# Altium schematic sheet 电源.SchDoc
size A4
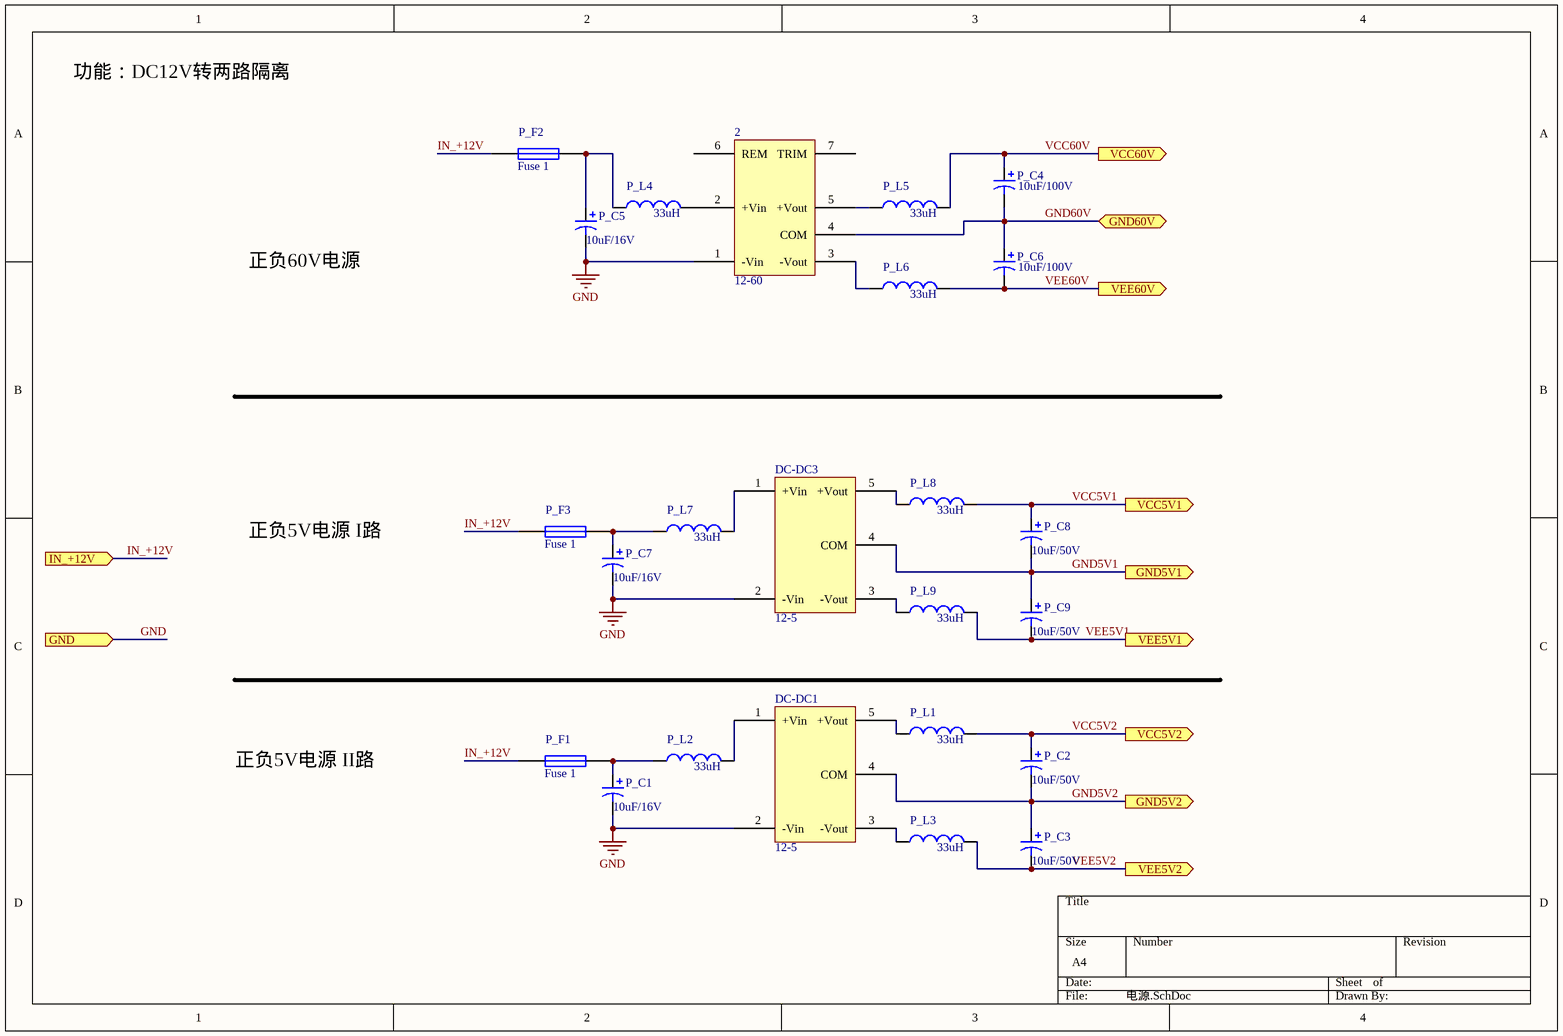
[diagram p0: 电源.SchDoc]

## Parts
2  12-60  [12-60]
DC-DC1  12-5  [12-5]
DC-DC3  12-5  [12-5]
P_C1  value 10uF/16V  [cap_2.54]  (hidden comment: Cap Pol3)
P_C2  value 10uF/50V  [cap_2.54]  (hidden comment: Cap Pol3)
P_C3  value 10uF/50V  [cap_2.54]  (hidden comment: Cap Pol3)
P_C4  10uF/100V  [cap_2.54]
P_C5  value 10uF/16V  [cap_2.54]  (hidden comment: Cap Pol3)
P_C6  10uF/100V  [cap_2.54]
P_C7  value 10uF/16V  [cap_2.54]  (hidden comment: Cap Pol3)
P_C8  value 10uF/50V  [cap_2.54]  (hidden comment: Cap Pol3)
P_C9  value 10uF/50V  [cap_2.54]  (hidden comment: Cap Pol3)
P_F1  Fuse 1  [HDR1X2]
P_F2  Fuse 1  [HDR1X2]
P_F3  Fuse 1  [HDR1X2]
P_L1  value 33uH  [AXIAL-0.4]  (hidden comment: Inductor)
P_L2  value 33uH  [AXIAL-0.4]  (hidden comment: Inductor)
P_L3  value 33uH  [AXIAL-0.4]  (hidden comment: Inductor)
P_L4  value 33uH  [AXIAL-0.4]  (hidden comment: Inductor)
P_L5  value 33uH  [AXIAL-0.4]  (hidden comment: Inductor)
P_L6  value 33uH  [AXIAL-0.4]  (hidden comment: Inductor)
P_L7  value 33uH  [AXIAL-0.4]  (hidden comment: Inductor)
P_L8  value 33uH  [AXIAL-0.4]  (hidden comment: Inductor)
P_L9  value 33uH  [AXIAL-0.4]  (hidden comment: Inductor)

## Ports
GND5V1 (out), GND5V2 (out), GND60V, GND (in), IN_+12V (in), VCC5V1 (out), VCC5V2 (out), VCC60V, VEE5V1 (out), VEE5V2 (out), VEE60V

## Nets
GND: 2.1(-Vin) DC-DC1.2(-Vin) DC-DC3.2(-Vin) P_C1.2 P_C5.2 P_C7.2 ; port GND
GND5V1: DC-DC3.4(COM) P_C8.2 P_C9.1 ; port GND5V1
GND5V2: DC-DC1.4(COM) P_C2.2 P_C3.1 ; port GND5V2
GND60V: 2.4(COM) P_C4.2 P_C6.1 ; port GND60V
IN_+12V: P_F1.1 P_F2.1 P_F3.1 ; port IN_+12V
VCC5V1: P_C8.1 P_L8.2 ; port VCC5V1
VCC5V2: P_C2.1 P_L1.2 ; port VCC5V2
VCC60V: P_C4.1 P_L5.2 ; port VCC60V
VEE5V1: P_C9.2 P_L9.2 ; port VEE5V1
VEE5V2: P_C3.2 P_L3.2 ; port VEE5V2
VEE60V: P_C6.2 P_L6.2 ; port VEE60V
Net2_2: 2.2(+Vin) P_L4.2
Net2_3: 2.3(-Vout) P_L6.1
Net2_5: 2.5(+Vout) P_L5.1
NetDC-DC1_1: DC-DC1.1(+Vin) P_L2.2
NetDC-DC1_3: DC-DC1.3(-Vout) P_L3.1
NetDC-DC1_5: DC-DC1.5(+Vout) P_L1.1
NetDC-DC3_1: DC-DC3.1(+Vin) P_L7.2
NetDC-DC3_3: DC-DC3.3(-Vout) P_L9.1
NetDC-DC3_5: DC-DC3.5(+Vout) P_L8.1
NetP_C1_1: P_C1.1 P_F1.2 P_L2.1
NetP_C5_1: P_C5.1 P_F2.2 P_L4.1
NetP_C7_1: P_C7.1 P_F3.2 P_L7.1

Not connected (* = marked no-connect by the designer): 2 6(REM) 7(TRIM)

## Notes on the sheet
- 功能：DC12V转两路隔离
- 正负60V电源
- 正负5V电源 I路
- 正负5V电源 II路

## Library data of the parts
P_C1-P_C3 P_C5 P_C7-P_C9 = Cap Pol3: Polarized Capacitor (Surface Mount); Published: 8-Jun-2000; LatestRevisionDate: 29-May-2009; LatestRevisionNote: IPC-7351 Footprint Added.; PackageReference: C0805; Publisher: Altium Limited; PackageDescription: Chip Capacitor
P_C4 P_C6 = Cap Pol3: Polarized Capacitor (Surface Mount); Value: 10uF/50V; Published: 8-Jun-2000; LatestRevisionDate: 29-May-2009; LatestRevisionNote: IPC-7351 Footprint Added.; PackageReference: C0805; Publisher: Altium Limited; PackageDescription: Chip Capacitor
P_F1-P_F3 = Fuse 1: Fuse; Published: 8-Jun-2000; LatestRevisionDate: 17-Jul-2002; LatestRevisionNote: Re-released for DXP Platform.; PackageReference: PIN-W2/E2.8; Publisher: Altium Limited; PackageDescription: Thru-Hole; 2 Leads
P_L1-P_L9 = Inductor: Code_IEC: 1005; Published: 8-Jun-2000; LatestRevisionDate: 29-May-2009; LatestRevisionNote: IPC-7351 Footprint Added.; PackageReference: 0402-A; Publisher: Altium Limited; PackageDescription: Chip Inductor; Code_JEITA: 0402